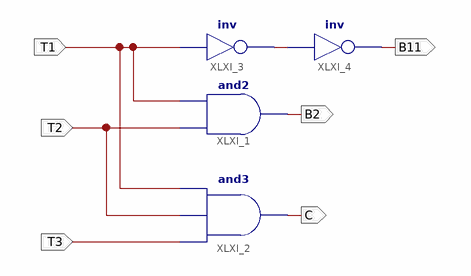
[diagram p0: schematic sheet 1]
// Xilinx ISE schematic ex06.sch (artix7) as structural Verilog: 4 symbols, 6 ports
module ex06 (
  input  T1,
  input  T2,
  input  T3,
  output B2,
  output C,
  output B11
);

  wire B1;

  and XLXI_1 (B2, T2, T1);
  and XLXI_2 (C, T3, T2, T1);
  not XLXI_3 (B1, T1);
  not XLXI_4 (B11, B1);
endmodule
